# Altium project GPS_Tracker_V1.PrjPcb
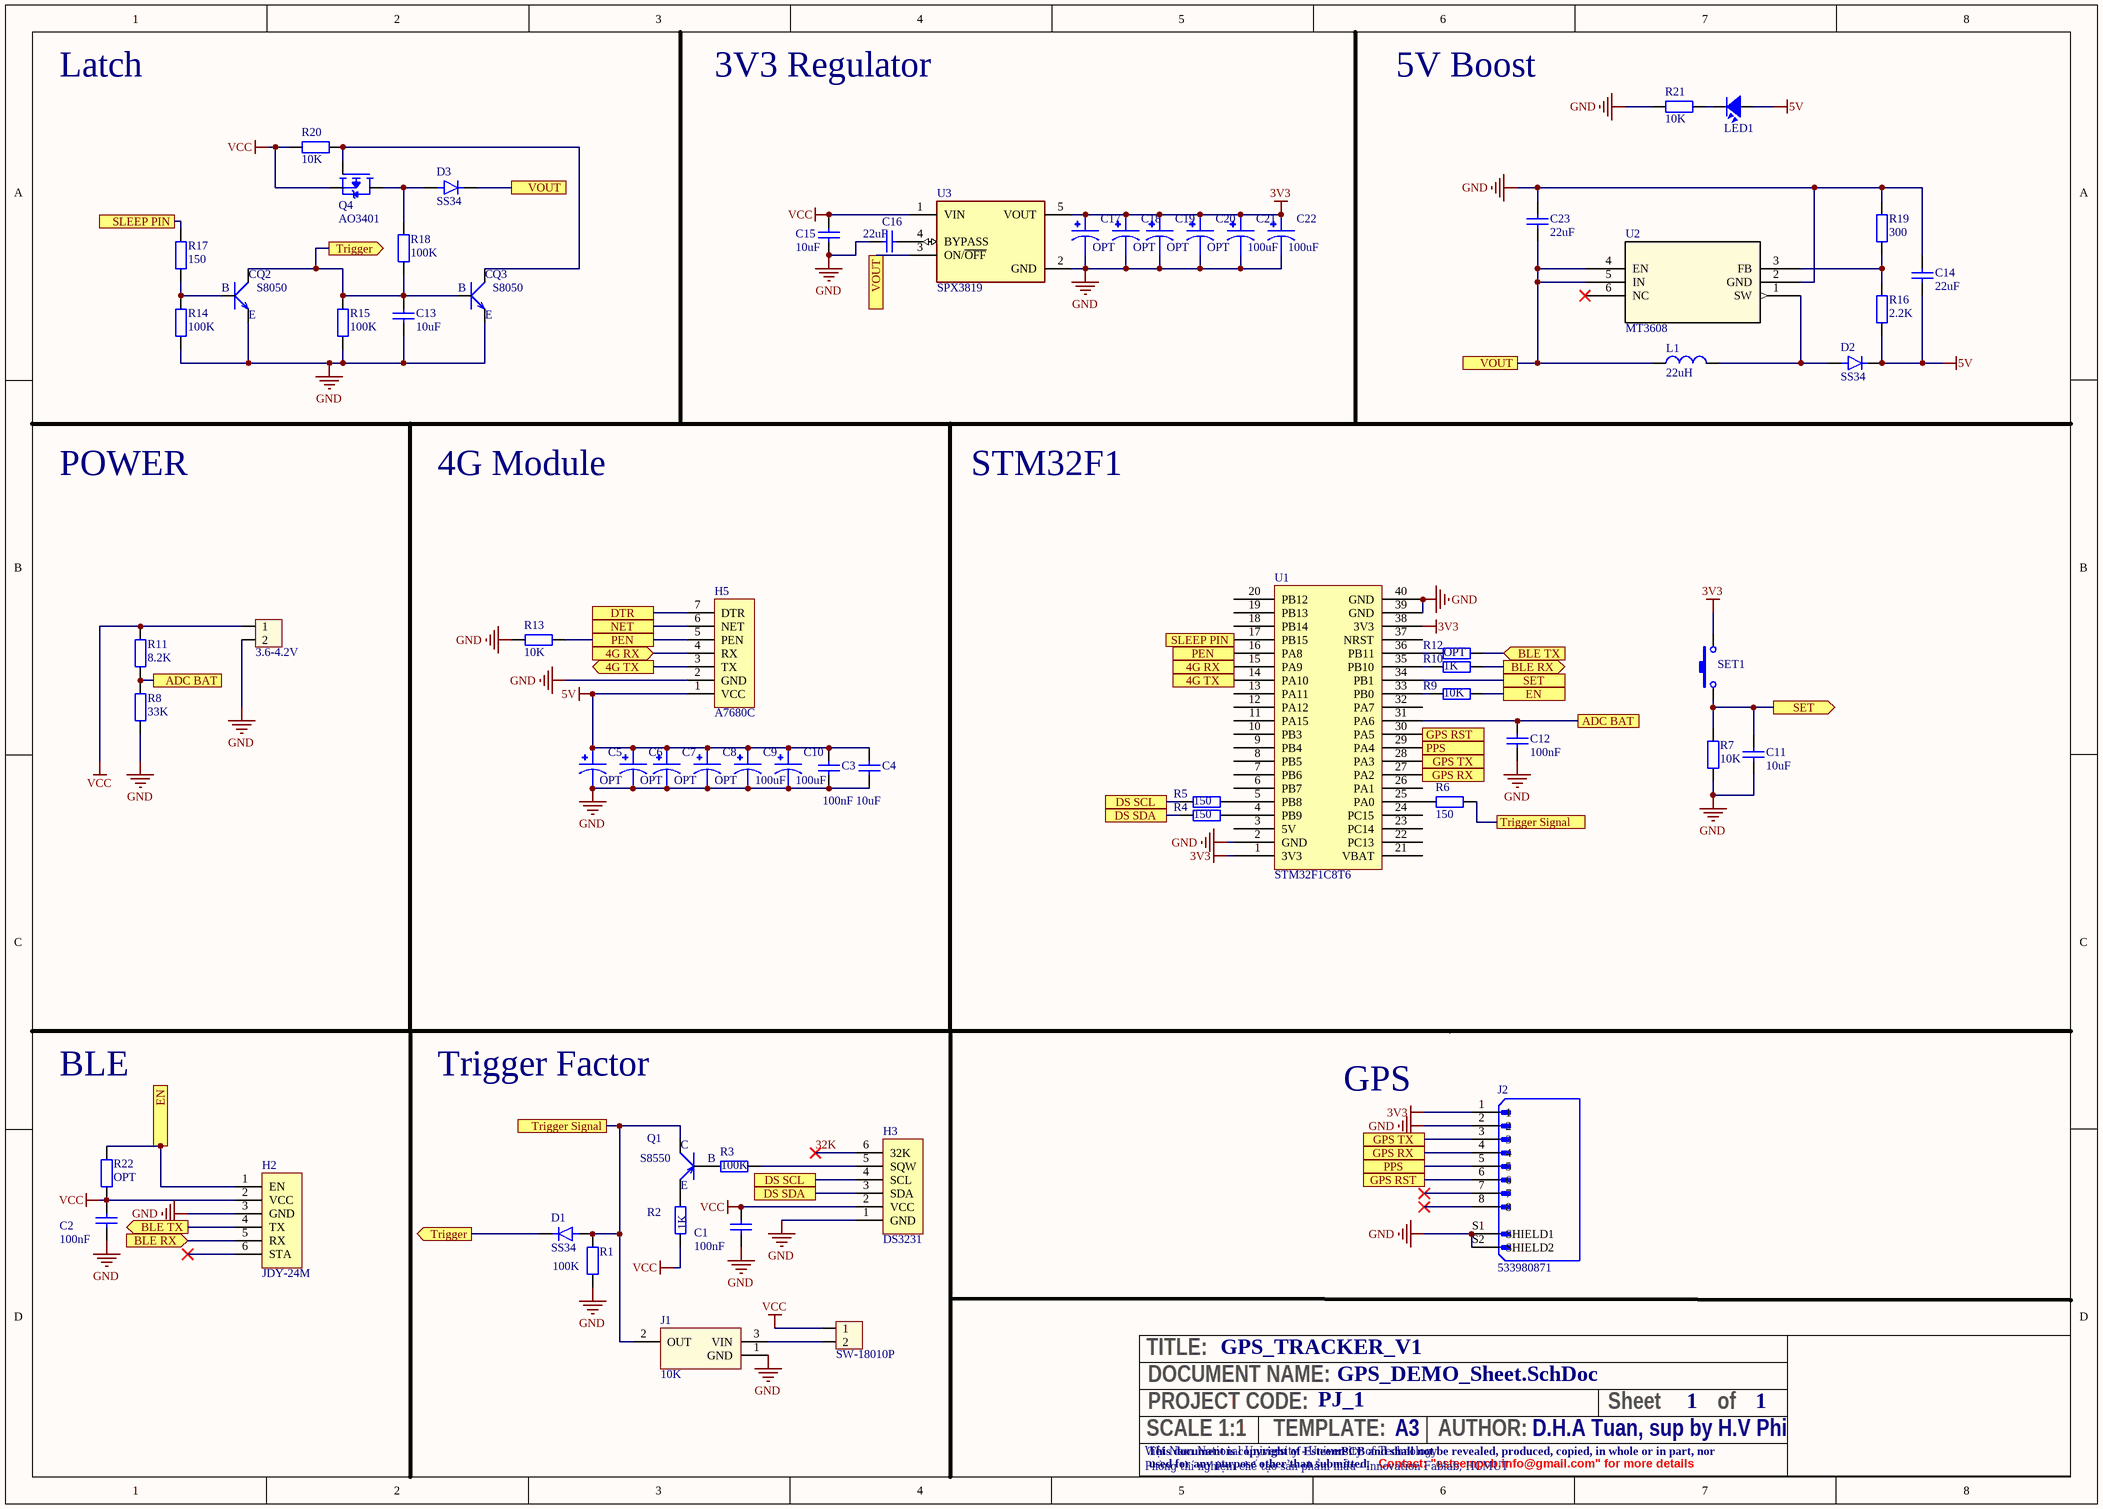
[diagram p0: GPS_DEMO_Sheet.SchDoc]
1 sheet, 65 parts. Net scope: flat (ports and power ports of the same name join across sheets).
Board file: GPS_DEMO_PCB.PcbDoc

## Sheet GPS_DEMO_Sheet.SchDoc: GPS_TRACKER_V1
size A3; Project: GPS_Tracker_V1; TotalSheet: 1; Company: AURAVINA; VersionRevision: 1; License: MIT; Address_City: HCM; Address_State_Zip: 00700; Address_Country: Viet Nam; Support, PCB Miling: H.V. Phi; Author: D.H.A Tuan, sup by H.V Phi; Organization: Altium Limited; Address1: HCMUT_Fablab; Address2: HCMUT_Fablab; Address3: HCMUT_Fablab; Address4: HCMUT_Fablab; DocumentNumber: 1; SheetNumber: 1; SheetTotal: 1; PROJECT CODE: PJ_1

### Parts
C1  100nF  [0805_Cap]
C2  100nF  [0805_Cap]
C3  100nF  [0805_Cap]
C4  10uF  [0805_Cap]
C5  OPT  [1206_Tantalum]
C6  OPT  [1206_Tantalum]
C7  OPT  [2312_Tantalum]
C8  OPT  [2312_Tantalum]
C9  100uF  [2917 _Tantalum]
C10  100uF  [2917 _Tantalum]
C11  10uF  [0805_Cap]
C12  100nF  [0805_Cap]
C13  10uF  [0805_Cap]
C14  22uF  [0805_Cap]
C15  10uF  [0805_Cap]
C16  22uF  [0805_Cap]
C17  OPT  [1206_Tantalum]
C18  OPT  [1206_Tantalum]
C19  OPT  [2312_Tantalum]
C20  OPT  [2312_Tantalum]
C21  100uF  [2917 _Tantalum]
C22  100uF  [2917 _Tantalum]
C23  22uF  [0805_Cap]
D1  SS34  [SODFL5226X100N]
D2  SS34  [SODFL5226X100N]
D3  SS34  [SODFL5226X100N]
H1  SW-18010P  [JP 1x2]
H2  JDY-24M  [Module JDY-24M]
H3  DS3231  [Module DS3231]
H4  3.6-4.2V  [KF301-2P]
H5  A7680C  [Module A7680C]
J1  10K  [RM065]
J2  533980871  [MOLEX_533980871]
L1  22uH  [INDUCTOR CDRH104]
LED1  LED  [0805_LED]  (value not drawn)
Q1  S8550  [SOT-23]
Q2  S8050  [SOT23]
Q3  S8050  [SOT23]
Q4  AO3401  [SOT23]
R1  100K  [0805_Res]
R2  1K  [0805_Res]
R3  100K  [0805_Res]
R4  150  [0805_Res]
R5  150  [0805_Res]
R6  150  [0805_Res]
R7  10K  [0805_Res]
R8  33K  [0805_Res]
R9  10K  [0805_Res]
R10  1K  [0805_Res]
R11  8.2K  [0805_Res]
R12  OPT  [0805_Res]
R13  10K  [0805_Res]
R14  100K  [0805_Res]
R15  100K  [0805_Res]
R16  2.2K  [0805_Res]
R17  150  [0805_Res]
R18  100K  [0805_Res]
R19  300  [0805_Res]
R20  10K  [0805_Res]
R21  10K  [0805_Res]
R22  OPT  [0805_Res]
SET1  Button 2p  [Button 2p 3x6x2.5]  (value not drawn)
U1  STM32F1C8T6  [Module STM32F1C8T6 BLUEPILL]
U2  MT3608  [TSOT23-6SOT23-6_AER]
U3  SPX3819  [SOT95P280X145-5N]

### Ports
4G RX (in), 4G RX (out), 4G TX (in), 4G TX (out), ADC BAT, BLE RX (in), BLE RX (out), BLE TX (in), BLE TX (out), DS SCL, DS SDA, DTR, EN, GPS RST, GPS RX, GPS RX (out), GPS TX, GPS TX (in), NET, PEN, PPS, SET, SET (out), SLEEP PIN, Trigger (out), Trigger Signal, VOUT

### Nets
3V3: C17.1 C18.1 C19.1 C20.1 C21.1 C22.1 J2.1 SET1.2 U1.1(3V3) U1.38(3V3) U3.5(VOUT)
5V: C3.1 C4.1 C5.1 C6.1 C7.1 C8.1 C9.1 C10.1 C14.2 D2.1(K) H5.1(VCC) LED1.A(Anode) R16.1
GND: C1.2 C2.2 C3.2 C4.2 C5.2 C6.2 C7.2 C8.2 C9.2 C10.2 C11.2 C12.2 C13.2 C14.1 C15.2 C16.2 C17.2 C18.2 C19.2 C20.2 C21.2 C22.2 C23.1 H2.3(GND) H3.1(GND) H4.2 H5.2(GND) J1.1(GND) J2.2 J2.S1(SHIELD1) J2.S2(SHIELD2) Q2.2(E) Q3.2(E) R1.1 R7.1 R8.1 R13.1 R14.1 R15.1 R19.2 R21.1 U1.2(GND) U1.39(GND) U1.40(GND) U2.2(GND) U3.2(GND)
VCC: C1.1 C2.1 C15.1 H1.1 H2.2(VCC) H3.2(VCC) H4.1 Q4.2(S) R2.1 R11.2 R20.1 R22.1 U3.1(VIN)
32K: H3.6(32K)
NetC11_1: C11.1 R7.2 SET1.1 U1.34(PB1) ; port SET
NetC12_1: C12.1 R8.2 R11.1 U1.31(PA6) ; port ADC BAT
NetC13_1: C13.1 D1.1(K) Q2.3(C) Q3.1(B) R15.2 R18.1 ; port Trigger
NetC16_1: C16.1 U3.4(BYPASS)
NetC23_2: C23.2 D3.1(K) L1.1 U2.4(EN) U2.5(IN) U3.3(ON/~{OFF}) ; port VOUT
NetD1_2: D1.2(A) J1.2(OUT) Q1.3(C) R1.2 R6.1 ; port Trigger Signal
NetD2_2: D2.2(A) L1.2 U2.1(SW)
NetD3_2: D3.2(A) Q4.3(D) R18.2
NetH1_2: H1.2 J1.3(VIN)
NetH2_1: H2.1(EN) R9.1 R22.2 ; port EN
NetH2_4: H2.4(TX) R12.1 ; port BLE TX
NetH2_5: H2.5(RX) R10.1 ; port BLE RX
NetH3_3: H3.3(SDA) R4.2 ; port DS SDA
NetH3_4: H3.4(SCL) R5.2 ; port DS SCL
NetH3_5: H3.5(SQW) R3.2
NetH5_3: H5.3(TX) U1.14(PA10) ; port 4G TX
NetH5_4: H5.4(RX) U1.15(PA9) ; port 4G RX
NetH5_5: H5.5(PEN) R13.2 U1.16(PA8) ; port PEN
NetH5_6: H5.6(NET) ; port NET
NetH5_7: H5.7(DTR) ; port DTR
NetJ2_3: J2.3 U1.28(PA3) ; port GPS TX
NetJ2_4: J2.4 U1.27(PA2) ; port GPS RX
NetJ2_5: J2.5 U1.29(PA4) ; port PPS
NetJ2_6: J2.6 U1.30(PA5) ; port GPS RST
NetLED1_C: LED1.C(Cathode) R21.2
NetQ1_1: Q1.1(B) R3.1
NetQ1_2: Q1.2(E) R2.2
NetQ2_1: Q2.1(B) R14.2 R17.1
NetQ3_3: Q3.3(C) Q4.1(G) R20.2
NetR4_1: R4.1 U1.4(PB9)
NetR5_1: R5.1 U1.5(PB8)
NetR6_2: R6.2 U1.25(PA0)
NetR9_2: R9.2 U1.33(PB0)
NetR10_2: R10.2 U1.35(PB10)
NetR12_2: R12.2 U1.36(PB11)
NetR16_2: R16.2 R19.1 U2.3(FB)
NetR17_2: R17.2 U1.17(PB15) ; port SLEEP PIN

Not connected (* = marked no-connect by the designer): H2 6(STA)*; J2 7* 8*; U1 3(5V) 6(PB7) 7(PB6) 8(PB5) 9(PB4) 10(PB3) 11(PA15) 12(PA12) 13(PA11) 18(PB14) 19(PB13) 20(PB12) 21(VBAT) 22(PC13) 23(PC14) 24(PC15) 26(PA1) 32(PA7) 37(NRST); U2 6(NC)*

### Notes on the sheet
- Latch
- 3V3 Regulator
- 5V Boost
- POWER
- 4G Module
- STM32F1
- BLE
- Trigger Factor
- GPS
- Việt Nam National University - University of Technology
- Phòng thí nghiệm chế tạo sản phẩm mẫu - Innovation Fablab, HCMUT
- TITLE:
- DOCUMENT NAME:
- SCALE 1:1
- This document is copyright of EsteemPCB and shall not be revealed, produced, copied, in whole or in part, nor
- PROJECT CODE:
- TEMPLATE:
- A3
- AUTHOR:
- Sheet
- of
- used for any purpose other than submitted.
- Contact: "esteempcb.info@gmail.com" for more details

### Library data of the parts
C1-C4 C11-C16 C23 = Ceramic Capacitor: Chung_Loai: Dán; Don_Vi: Con; So_Chan: 2; Ten_Linh_Kien: Tụ 0805 104-100nF 10% 50V; Ma_Hang: MH004551; Kieu_Chan: *
C5-C10 C17-C22 = Tantalum: Molded Tantalum Capacitors
D1-D3 = SS34ALH: 3A, 40V, Schottky Rectifier; MF: Taiwan Semiconductor; Package: DO-221AC Taiwan Semiconductor; MP: SS34ALH; Value: *; SnapEDA_Link: https://www.snapeda.com/parts/SS34ALH/Taiwan+Semiconductor/view-part/?ref=snap; Availability: Not in stock; Price: None; Check_prices: https://www.snapeda.com/parts/SS34ALH/Taiwan+Semiconductor/view-part/?ref=eda
H1 H4 = Header 2P: THT; Ten_Linh_Kien: Header 2P XH2.54-2P Đực Cong; Don_Vi: Con; Ma_Hang: MH002852; Chung_Loai: Cắm
H2 = Module JDY-24M: Module BLE JDY-24M Bluetooth module 6p
H3 = Module DS3231: Module RTC (Real Time Clock) DS3231 6p
H5 = Module A7680C: SIM Module A7680C; A7672S 4G
J1 = RM065: Circuit Breaker Thermal 6.5A 240V AC 60V DC Rocker Panel Mount, Snap-In; MP: RM-065; MF: Vishay; Value: *; Package: None; Availability: Not in stock; SnapEDA_Link: https://www.snapeda.com/parts/RM-065/Vishay/view-part/?ref=snap; Price: None; Check_prices: https://www.snapeda.com/parts/RM-065/Vishay/view-part/?ref=eda
J2 = 533980871: MX 1.25mm 8 pin;Conn; Rect; Header; 1.25 mm Pitch; PCB; 8 Cir; Ver; SMT; PicoBlade; LF | Molex Incorporated 53398-0871; Price: None; MP: 533980871; Availability: Unavailable; Value: *; Package: None
L1 = Inductor: Inductors from EPCOS include SMT Inductors, SMT Power Inductors, Transponder Coils, ISDN Transformers, xDSL Transformers, DC/DC Converters, RF Transformers and SMT Current Sense Transformers.; MP: B82477G4472M000; Price: None; SnapEDA_Link: https://www.snapeda.com/parts/B82477G4472M000/EPCOS/view-part/?ref=snap; Package: NON STANDARD-2 EPCOS; Value: *; Check_prices: https://www.snapeda.com/parts/B82477G4472M000/EPCOS/view-part/?ref=eda; Availability: In Stock; MF: EPCOS; Purchase-URL: https://pricing.snapeda.com/search/part/B82477G4472M000/?ref=eda
LED1 = LED: LED single color 2 leads
Q1 = S8550: Bipolar (BJT) Transistor PNP SOT-23; MF: UMW; MP: S8050; Purchase-URL: https://banlinhkien.com/s8050-sot23-trans-npn-0.5a-40v-j3y-10c-p15943539.html; Check_prices: https://banlinhkien.com/s8050-sot23-trans-npn-0.5a-40v-j3y-10c-p15943539.html; SnapEDA_Link: https://www.snapeda.com/parts/S8050/Umwelt+Sensor+Teknik/view-part/?ref=snap; Price: None; Availability: In Stock; Package: None; Value: *
Q2 Q3 = S8050: Bipolar (BJT) Transistor NPN SOT-23; MF: UMW; Purchase-URL: https://banlinhkien.com/s8050-sot23-trans-npn-0.5a-40v-j3y-10c-p15943539.html; Check_prices: https://banlinhkien.com/s8050-sot23-trans-npn-0.5a-40v-j3y-10c-p15943539.html; Link: https://banlinhkien.com/s8050-sot23-trans-npn-0.5a-40v-j3y-10c-p15943539.html; Price: None; Availability: In Stock; Package: None; MP: S8050; Value: *
Q4 = AO3401: Mosfet P-Channel 30 V 4A (Ta) 1.4W (Ta) Surface Mount SOT-23-3; MF: Alpha &; SnapEDA_Link: https://www.snapeda.com/parts/AO3401/Alpha+%2526+Omega+Semiconductor+Inc./view-part/?ref=snap; Package: TO-236-3 Alpha &amp; Omega Semiconductor Inc.; Value: *; MP: AO3401; Check_prices: https://www.snapeda.com/parts/AO3401/Alpha+%2526+Omega+Semiconductor+Inc./view-part/?ref=eda
R1-R22 = Resistor: Chung_Loai: Dán; Don_Vi: Con; So_Chan: 2; Ten_Linh_Kien: Trở 0805 1% 1k; Ma_Hang: MH005468; Kieu_Chan: *
SET1 = Button 2p: Nut Nhan 2 Chan SMD 3x6x2.5; Ma_Hang: MH001036; Ten: Nút Nhấn 2 Chân 3x6x2.5MM SMD
U1 = Module STM32F1C8T6 BLUEPILL: Module stm32f1 Bluepill
U2 = MT3608: No Description Available; Mfr_Name: Aerosemi; RefDes: RefDes; Type: Type
U3 = LP2985-33DBVR: 150-mA, 16-V, low-dropout voltage regulator with enable 5-SOT-23 -40 to 125; Package: None; Value: *; Price: None; MP: LP2985-33DBVR; Availability: Unavailable